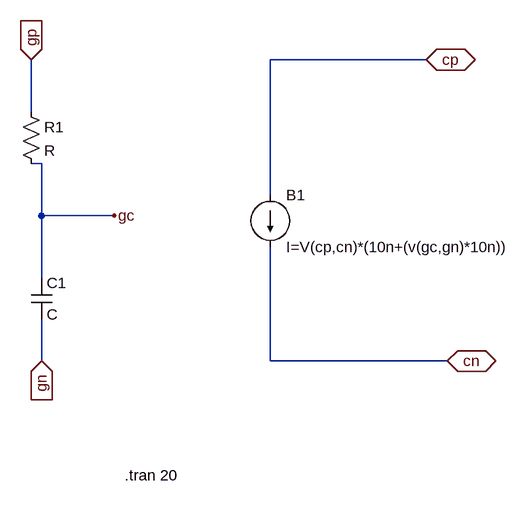
[diagram p0: schematic capteur.asc]
capteur.asc, the LTspice schematic file:
Version 4
SHEET 1 880 680
WIRE 464 16 224 16
WIRE -144 96 -144 16
WIRE -128 176 -144 176
WIRE 224 224 224 16
WIRE -128 256 -128 176
WIRE -16 256 -128 256
WIRE -128 352 -128 256
WIRE -128 480 -128 416
WIRE 224 480 224 304
WIRE 496 480 224 480
FLAG -128 480 gn
IOPIN -128 480 In
FLAG -144 16 gp
IOPIN -144 16 In
FLAG -16 256 gc
FLAG 464 16 cp
IOPIN 464 16 BiDir
FLAG 496 480 cn
IOPIN 496 480 BiDir
SYMBOL res -160 80 R0
SYMATTR InstName R1
SYMBOL cap -144 352 R0
SYMATTR InstName C1
SYMBOL current 224 224 R0
SYMATTR InstName B1
SYMATTR Value I=V(cp,cn)*(10n+(v(gc,gn)*10n))
TEXT 0 656 Left 2 !.tran 20

The netlist it stands for:
* capteur.asc
R1 gp gc R
C1 gc gn C
I§B1 cp cn I=V(cp,cn)*(10n+(v(gc,gn)*10n))
.tran 20
.backanno
.end